# EAGLE design Gibbot (EAGLE 5.12)
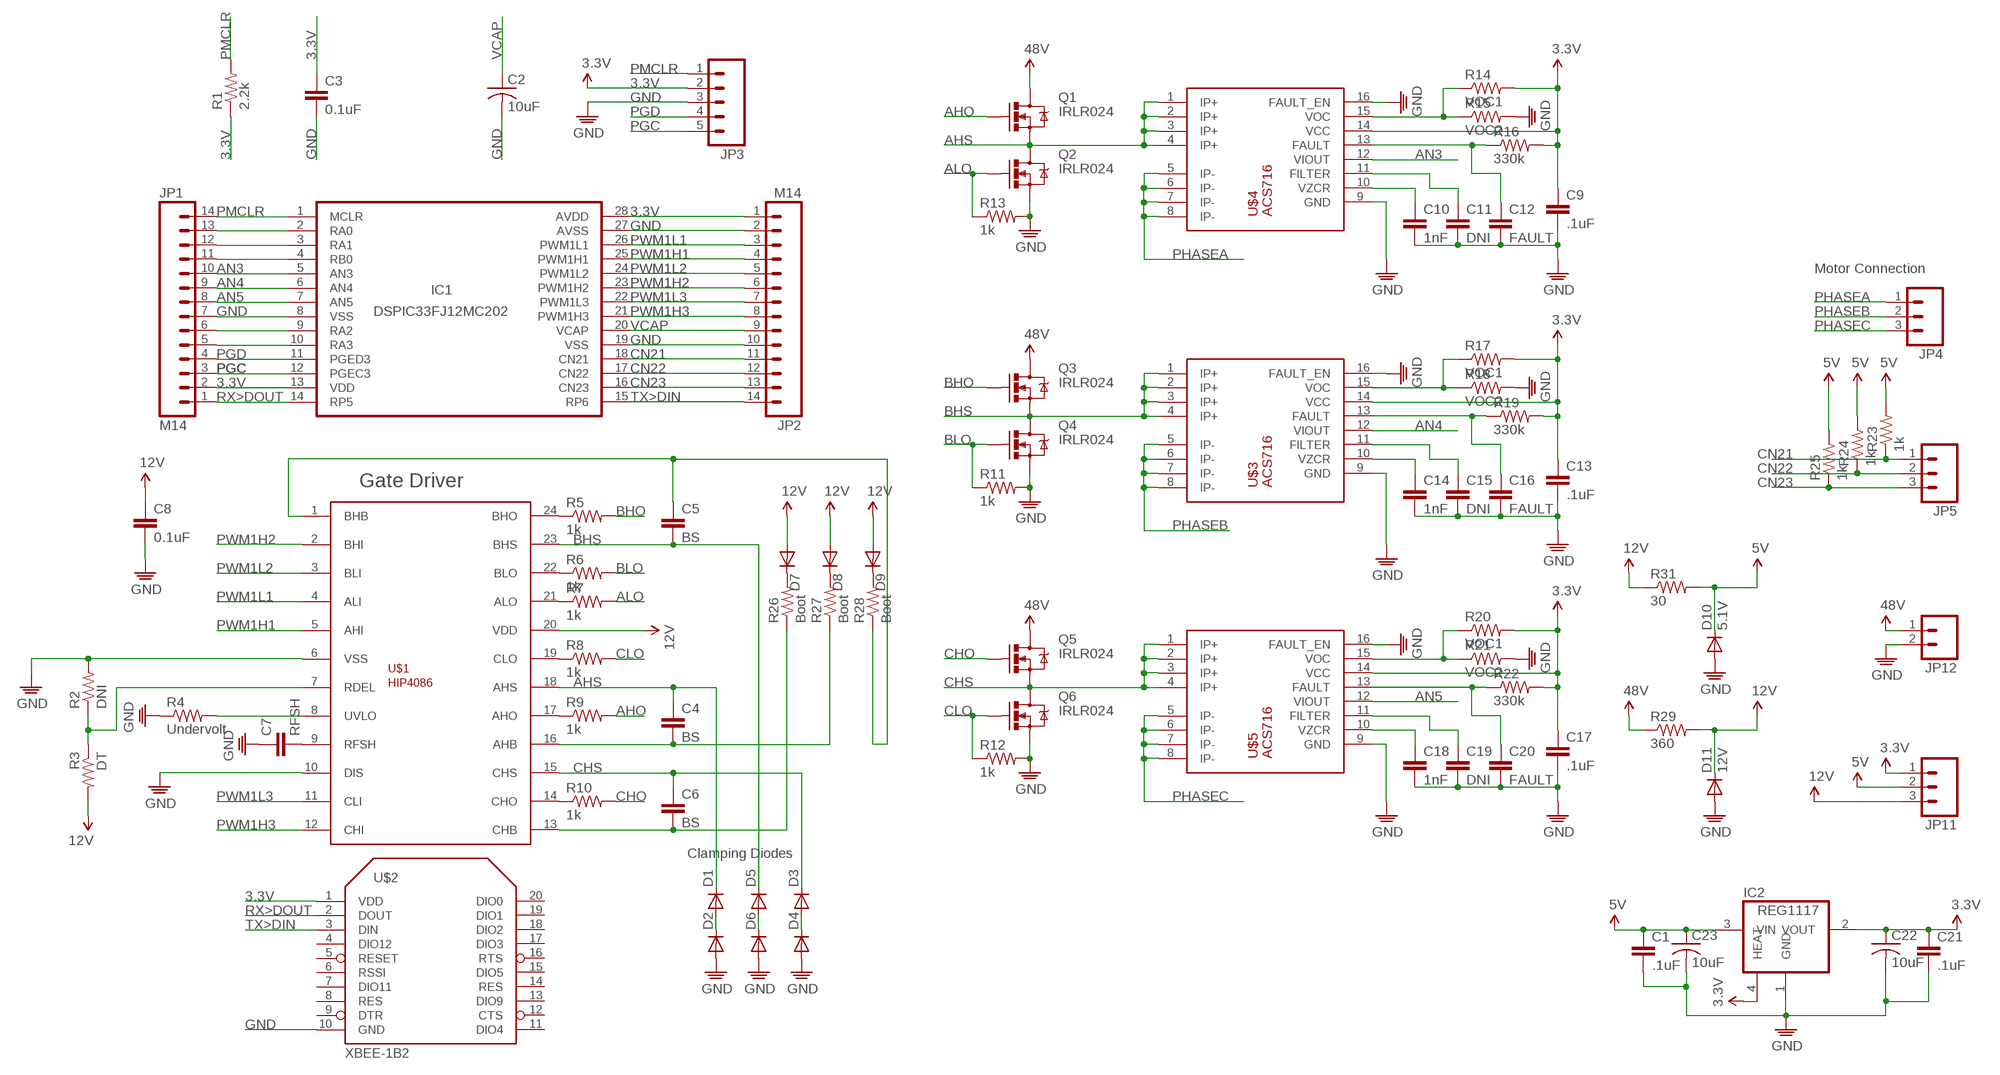
[diagram p0: schematic, sheet 1]

## Parts
C1  .1uF  CAP0603-CAP  [0603-CAP]
C2  10uF  C-USC0603  [C0603]
C3  0.1uF  CAP0603-CAP  [0603-CAP]
C4  BS  CAP0603-CAP  [0603-CAP]
C5  BS  CAP0603-CAP  [0603-CAP]
C6  BS  CAP0603-CAP  [0603-CAP]
C7  RFSH  CAP0603-CAP  [0603-CAP]
C8  0.1uF  CAP0603-CAP  [0603-CAP]
C9  .1uF  CAP0603-CAP  [0603-CAP]
C10  1nF  CAP0603-CAP  [0603-CAP]
C11  DNI  CAP0603-CAP  [0603-CAP]
C12  FAULT  CAP0603-CAP  [0603-CAP]
C13  .1uF  CAP0603-CAP  [0603-CAP]
C14  1nF  CAP0603-CAP  [0603-CAP]
C15  DNI  CAP0603-CAP  [0603-CAP]
C16  FAULT  CAP0603-CAP  [0603-CAP]
C17  .1uF  CAP0603-CAP  [0603-CAP]
C18  1nF  CAP0603-CAP  [0603-CAP]
C19  DNI  CAP0603-CAP  [0603-CAP]
C20  FAULT  CAP0603-CAP  [0603-CAP]
C21  .1uF  CAP0603-CAP  [0603-CAP]
C22  10uF  C-USC0603  [C0603]
C23  10uF  C-USC0603  [C0603]
D1  DIODEPTH  [DIODE-1N4001]
D2  DIODEPTH  [DIODE-1N4001]
D3  DIODEPTH  [DIODE-1N4001]
D4  DIODEPTH  [DIODE-1N4001]
D5  DIODEPTH  [DIODE-1N4001]
D6  DIODEPTH  [DIODE-1N4001]
D7  DIODEPTH  [DIODE-1N4001]
D8  DIODEPTH  [DIODE-1N4001]
D9  DIODEPTH  [DIODE-1N4001]
D10  5.1V  DIODEPTH  [DIODE-1N4001]
D11  12V  DIODEPTH  [DIODE-1N4001]
IC1  DSPIC33FJ12MC202  [SOIC28-W]
IC2  REG1117  [SOT223]
JP1  M14  [1X14]
JP2  M14  [1X14]
JP3  M05PTH  [1X05]
JP4  M03-SCREW-5MM  [SCREWTERMINAL-5MM-3]
JP5  M03-SCREW-5MM  [SCREWTERMINAL-5MM-3]
JP11  M03-SCREW-5MM  [SCREWTERMINAL-5MM-3]
JP12  M025MM  [SCREWTERMINAL-5MM-2]
Q1  IRLR024  [DPAK]
Q2  IRLR024  [DPAK]
Q3  IRLR024  [DPAK]
Q4  IRLR024  [DPAK]
Q5  IRLR024  [DPAK]
Q6  IRLR024  [DPAK]
R1  2.2k  R-US_R0603  [R0603]
R2  DNI  R-US_R0603  [R0603]
R3  DT  R-US_R0603  [R0603]
R4  Undervolt  R-US_R0603  [R0603]
R5  1k  R-US_R0603  [R0603]
R6  1k  R-US_R0603  [R0603]
R7  1k  R-US_R0603  [R0603]
R8  1k  R-US_R0603  [R0603]
R9  1k  R-US_R0603  [R0603]
R10  1k  R-US_R0603  [R0603]
R11  1k  R-US_R0603  [R0603]
R12  1k  R-US_R0603  [R0603]
R13  1k  R-US_R0603  [R0603]
R14  VOC1  R-US_R0603  [R0603]
R15  VOC2  R-US_R0603  [R0603]
R16  330k  R-US_R0603  [R0603]
R17  VOC1  R-US_R0603  [R0603]
R18  VOC2  R-US_R0603  [R0603]
R19  330k  R-US_R0603  [R0603]
R20  VOC1  R-US_R0603  [R0603]
R21  VOC2  R-US_R0603  [R0603]
R22  330k  R-US_R0603  [R0603]
R23  1k  R-US_R0603  [R0603]
R24  1k  R-US_R0603  [R0603]
R25  1k  R-US_R0603  [R0603]
R26  Boot  R-US_R0603  [R0603]
R27  Boot  R-US_R0603  [R0603]
R28  Boot  R-US_R0603  [R0603]
R29  360  R-US_SQP500  [SQP500]
R31  30  R-US_0414/17  [0414/17]
U$1  HIP4086  [SOIC24-W]
U$2  XBEE-1B2  [XBEE-SILK]
U$3  ACS716  [SOIC16-W]
U$4  ACS716  [SOIC16-W]
U$5  ACS716  [SOIC16-W]

## Nets
3.3V: C3.1 C9.1 C13.1 C17.1 C21.1 C22.1 IC1.13(VDD) IC1.28(AVDD) IC2.2(VOUT) IC2.4(HEAT) JP1.2 JP2.1 JP3.2 JP11.1 R1.1 R14.2 R16.2 R17.2 R19.2 R20.2 R22.2 U$2.1(VDD) U$3.14(VCC) U$4.14(VCC) U$5.14(VCC)
5V: C1.1 C23.1 D10.C IC2.3(VIN) JP11.2 R23.2 R24.2 R25.2 R31.2
12V: C8.1 D7.A D8.A D9.A D11.C JP11.3 R3.2 R29.P$2 R31.1 U$1.20(VDD)
48V: JP12.1 Q1.D Q3.D Q5.D R29.P$1
AHO: Q1.G R9.2
AHS: C4.1 D1.C Q1.S Q2.D U$1.18(AHS) U$4.1(IP+) U$4.2(IP+) U$4.3(IP+) U$4.4(IP+)
ALO: Q2.G R7.2 R13.1
AN3: IC1.5(AN3) JP1.10 U$4.12(VIOUT)
AN4: IC1.6(AN4) JP1.9 U$3.12(VIOUT)
AN5: IC1.7(AN5) JP1.8 U$5.12(VIOUT)
BHO: Q3.G R5.2
BHS: C5.2 D5.C Q3.S Q4.D U$1.23(BHS) U$3.1(IP+) U$3.2(IP+) U$3.3(IP+) U$3.4(IP+)
BLO: Q4.G R6.2 R11.1
CHO: Q5.G R10.2
CHS: C6.1 D3.C Q5.S Q6.D U$1.15(CHS) U$5.1(IP+) U$5.2(IP+) U$5.3(IP+) U$5.4(IP+)
CLO: Q6.G R8.2 R12.1
CN21: IC1.18(CN21) JP2.11 JP5.1 R23.1
CN22: IC1.17(CN22) JP2.12 JP5.2 R24.1
CN23: IC1.16(CN23) JP2.13 JP5.3 R25.1
GND: C1.2 C2.2 C3.2 C7.1 C8.2 C9.2 C10.2 C11.2 C12.2 C13.2 C14.2 C15.2 C16.2 C17.2 C18.2 C19.2 C20.2 C21.2 C22.2 C23.2 D2.A D4.A D6.A D10.A D11.A IC1.8(VSS) IC1.19(VSS) IC1.27(AVSS) IC2.1(GND) JP1.7 JP2.2 JP2.10 JP3.3 JP12.2 Q2.S Q4.S Q6.S R2.2 R4.1 R11.2 R12.2 R13.2 R15.2 R18.2 R21.2 U$1.6(VSS) U$1.10(DIS) U$2.10(GND) U$3.9(GND) U$3.16(FAULT_EN) U$4.9(GND) U$4.16(FAULT_EN) U$5.9(GND) U$5.16(FAULT_EN)
N$1: C4.2 R27.1 U$1.16(AHB)
N$2: C6.2 R26.1 U$1.13(CHB)
N$3: R4.2 U$1.8(UVLO)
N$4: C5.1 R28.1 U$1.1(BHB)
N$5: IC1.10(RA3) JP1.5
N$6: IC1.9(RA2) JP1.6
N$7: R2.1 R3.1 U$1.7(RDEL)
N$11: IC1.4(RB0) JP1.11
N$12: IC1.3(RA1) JP1.12
N$13: IC1.2(RA0) JP1.13
N$14: C7.2 U$1.9(RFSH)
N$15: R10.1 U$1.14(CHO)
N$16: R9.1 U$1.17(AHO)
N$17: R8.1 U$1.19(CLO)
N$18: R7.1 U$1.21(ALO)
N$19: R6.1 U$1.22(BLO)
N$20: R5.1 U$1.24(BHO)
N$24: D1.A D2.C
N$28: D3.A D4.C
N$29: D5.A D6.C
N$32: R14.1 R15.1 U$4.15(VOC)
N$33: C12.1 R16.1 U$4.13(FAULT)
N$35: C10.1 U$4.10(VZCR)
N$36: C11.1 U$4.11(FILTER)
N$37: R17.1 R18.1 U$3.15(VOC)
N$38: C16.1 R19.1 U$3.13(FAULT)
N$39: C14.1 U$3.10(VZCR)
N$40: C15.1 U$3.11(FILTER)
N$43: R20.1 R21.1 U$5.15(VOC)
N$44: C20.1 R22.1 U$5.13(FAULT)
N$45: C18.1 U$5.10(VZCR)
N$46: C19.1 U$5.11(FILTER)
N$53: D8.C R27.2
N$54: D9.C R28.2
N$55: D7.C R26.2
PGC: IC1.12(PGEC3) JP1.3 JP3.5
PGD: IC1.11(PGED3) JP1.4 JP3.4
PHASEA: JP4.1 U$4.5(IP-) U$4.6(IP-) U$4.7(IP-) U$4.8(IP-)
PHASEB: JP4.2 U$3.5(IP-) U$3.6(IP-) U$3.7(IP-) U$3.8(IP-)
PHASEC: JP4.3 U$5.5(IP-) U$5.6(IP-) U$5.7(IP-) U$5.8(IP-)
PMCLR: IC1.1(MCLR) JP1.14 JP3.1 R1.2
PWM1H1: IC1.25(PWM1H1) JP2.4 U$1.5(AHI)
PWM1H2: IC1.23(PWM1H2) JP2.6 U$1.2(BHI)
PWM1H3: IC1.21(PWM1H3) JP2.8 U$1.12(CHI)
PWM1L1: IC1.26(PWM1L1) JP2.3 U$1.4(ALI)
PWM1L2: IC1.24(PWM1L2) JP2.5 U$1.3(BLI)
PWM1L3: IC1.22(PWM1L3) JP2.7 U$1.11(CLI)
RX>DOUT: IC1.14(RP5) JP1.1 U$2.2(DOUT)
TX>DIN: IC1.15(RP6) JP2.14 U$2.3(DIN)
VCAP: C2.1 IC1.20(VCAP) JP2.9
Unconnected: U$2.4(DIO12) U$2.5(RESET) U$2.6(RSSI) U$2.7(DIO11) U$2.8(RES) U$2.9(DTR) U$2.11(DIO4) U$2.12(CTS) U$2.13(DIO9) U$2.14(RES) U$2.15(DIO5) U$2.16(RTS) U$2.17(DIO3) U$2.18(DIO2) U$2.19(DIO1) U$2.20(DIO0)

## Notes on the sheet
- Motor Connection
- Gate Driver
- Clamping Diodes

## Library data of the parts
C1 C3-C21 = Gibbot:CAP: Capacitor Standard 0603 ceramic capacitor, and 0.1" leaded capacitor.
C2 C22 C23 = Gibbot:C-US: CAPACITOR, American symbol
D1-D11 = Gibbot:DIODE: Diode These are standard reverse protection diodes and small signal diodes. SMA package can handle up to about 1A. SOD-323 can handle about 200mA. What the SOD-323 package when ordering, there are some mfgs out there that are 5-pin packages.
IC1 = Gibbot:DSPIC33FJ12MC202: dsPIC33FJ12MC202 edit this description Auto generated by make-symbol-device-package-bsdl.ulp Rev. 25 Source: dsPIC33FJ12MC202.bsd
IC2 = Gibbot:REG1117: 800mA and 1A Low Dropout (LDO) Positive Regulator 1.8V, 2.5V, 2.85V, 3.3V, 5V, and Adj
JP1 JP2 = Gibbot:M14: Header 14 Standard 14-pin 0.1" header. Use with straight break away headers (SKU : PRT-00116), right angle break away headers (PRT-00553), swiss pins (PRT-00743), machine pins (PRT-00117), and female headers (PRT-00115).
JP3 = Gibbot:M05: Header 5 Standard 5-pin 0.1" header. Use with straight break away headers (SKU : PRT-00116), right angle break away headers (PRT-00553), swiss pins (PRT-00743), machine pins (PRT-00117), and female headers (PRT-00115). Molex polarized connector foot print use with SKU : PRT-08230 with associated crimp pins and housings.
JP4 JP5 JP11 = Gibbot:M03: Header 3 Standard 3-pin 0.1" header. Use with straight break away headers (SKU : PRT-00116), right angle break away headers (PRT-00553), swiss pins (PRT-00743), machine pins (PRT-00117), and female headers (PRT-00115). Molex polarized connector foot print use with SKU : PRT-08232 with associated crimp pins and housings.
JP12 = Gibbot:M02: Header 2 Standard 2-pin 0.1" header. Use with straight break away headers (SKU : PRT-00116), right angle break away headers (PRT-00553), swiss pins (PRT-00743), machine pins (PRT-00117), and female headers (PRT-00115). Molex polarized connector foot print use with SKU : PRT-08233 with associated crimp pins and housings.
Q1-Q6 = Gibbot:IRLR024
R1-R29 R31 = Gibbot:R-US_: RESISTOR, American symbol
U$1 = Gibbot:HIP4086
U$2 = Gibbot:XBEE-1
U$3-U$5 = Gibbot:ACS716

## Board
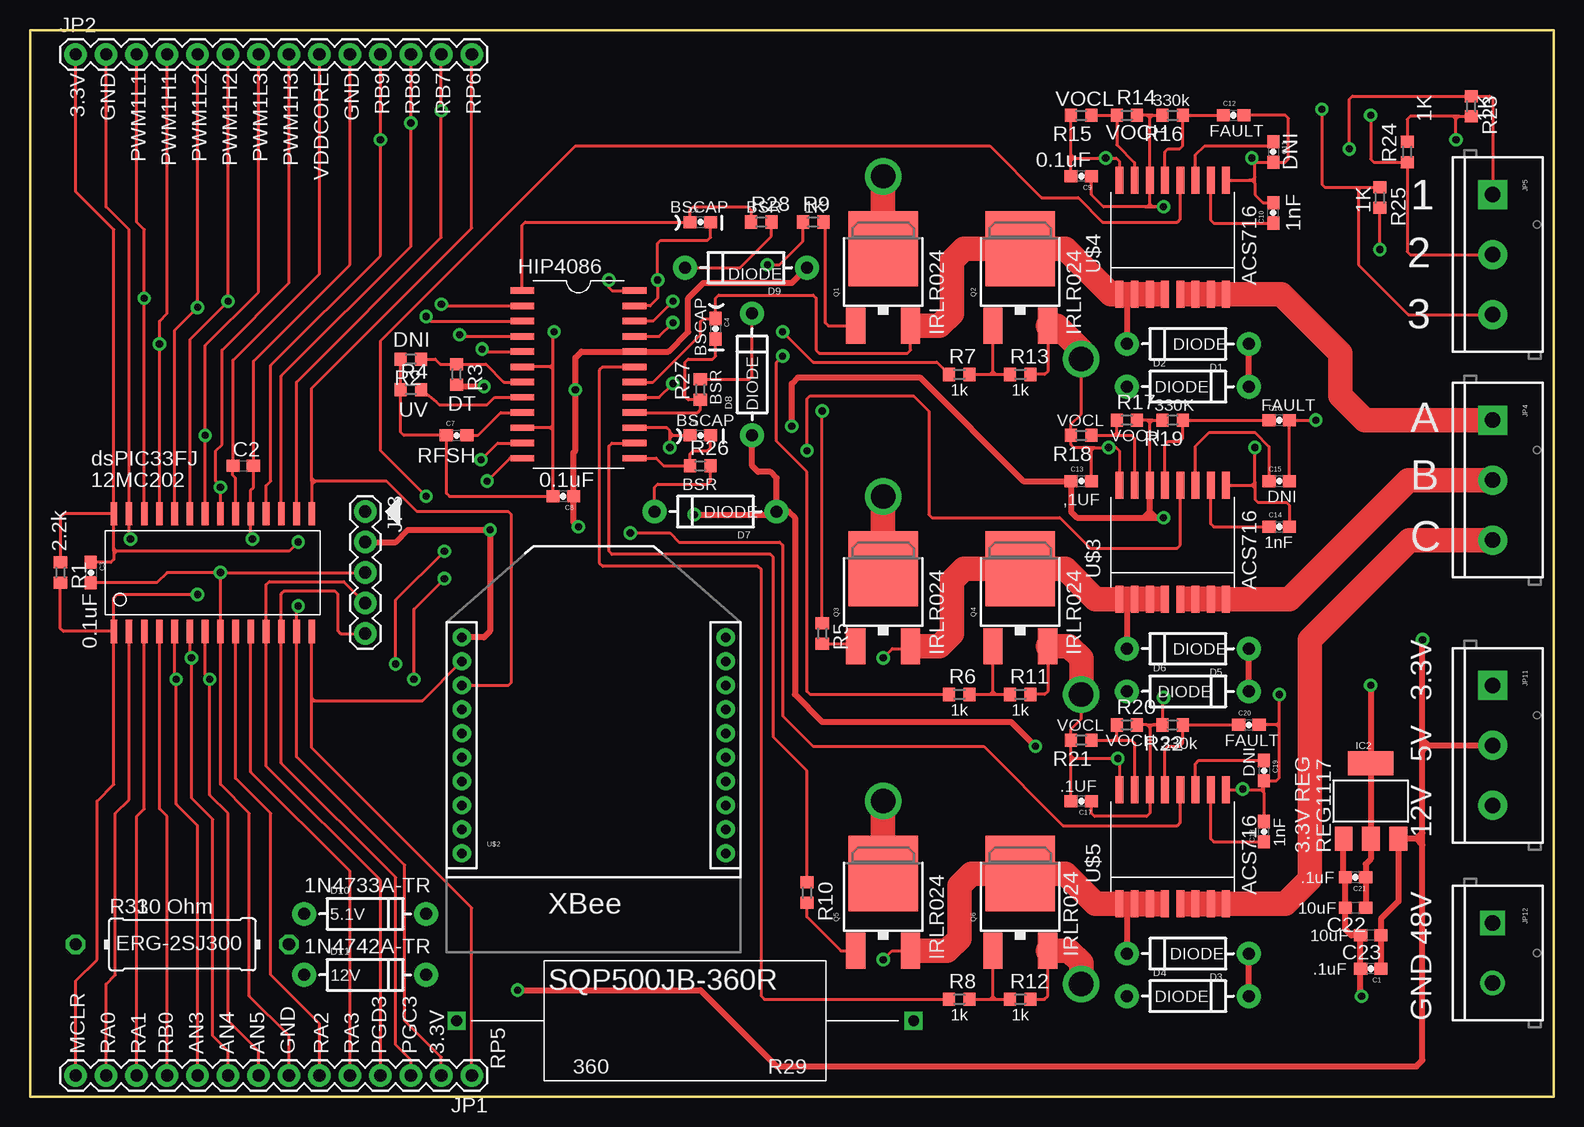
[diagram p1: board, top side]
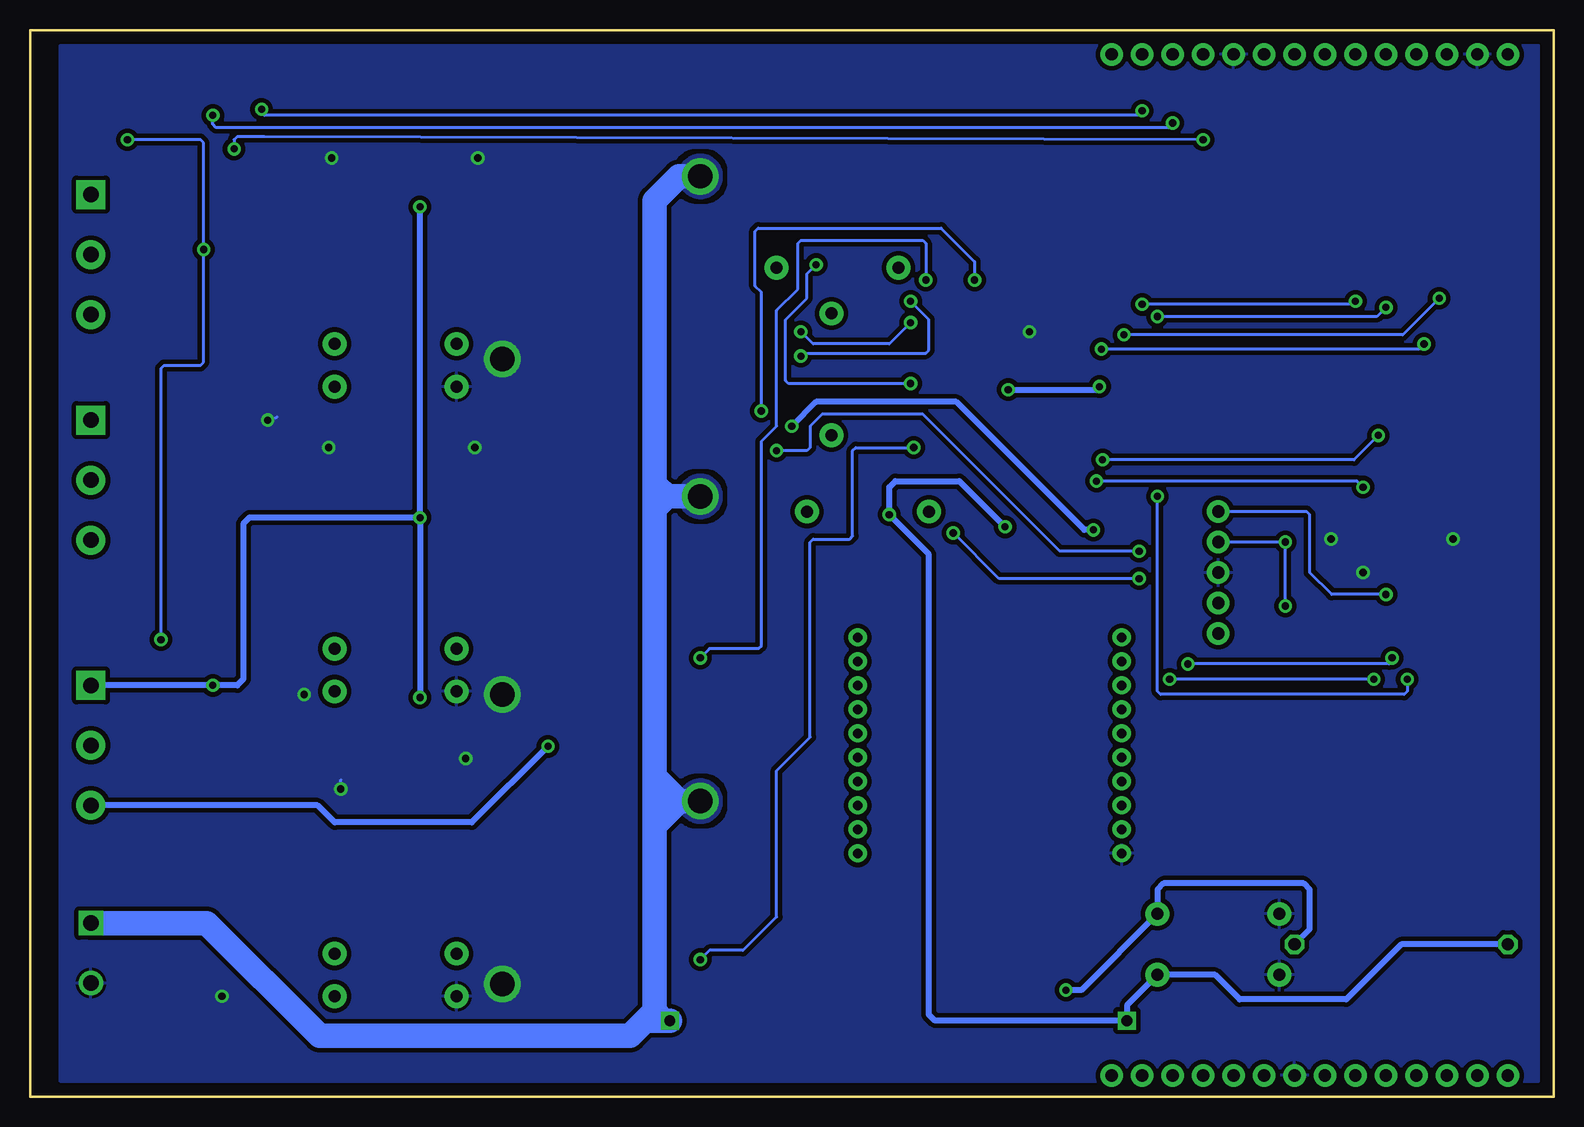
[diagram p2: board, bottom side, seen from below]

Size 127 x 88.9 mm. Coordinates in mm from the lower left corner, seen from the top.
Outline: 0,0 127,0 127,88.9 0,88.9 0,0
Copper layers (1*16): Top 0.035mm / dielectric 1.5mm / Bottom 0.035mm
Design rules "SparkFun": minimum track width 8mil, minimum drill 20mil, track to track 8mil, track to pad 8mil, pad to pad 8mil, via to via 8mil, smd to smd 8mil, copper to edge 10mil, drill to drill 8mil, minimum pad ring 12mil, minimum via ring 10mil, stop-mask expansion 4mil, vias tented up to drill 25mil, thermal gap 10mil
Holes 1.1 mm at -3.81,3.81

### Footprints (pad centres in the part's own frame; a part is rotated, then mirrored left to right if it is on the bottom)
0603-CAP = smd 1.1 x 1: 1 -0.85,0; 2 0.85,0
C0603 = smd 1.1 x 1: 1 -0.85,0; 2 0.85,0
DIODE-1N4001 = drill 1 pad 1.981 round: A -5.08,0; C 5.08,0
SOIC28-W = smd 0.55 x 1.95: 1 -8.255,-4.9; 2 -6.985,-4.9; 3 -5.715,-4.9; 4 -4.445,-4.9; 5 -3.175,-4.9; 6 -1.905,-4.9; 7 -0.635,-4.9; 8 0.635,-4.9; 9 1.905,-4.9; 10 3.175,-4.9; 11 4.445,-4.9; 12 5.715,-4.9; 13 6.985,-4.9; 14 8.255,-4.9; 15 8.255,4.9; 16 6.985,4.9; 17 5.715,4.9; 18 4.445,4.9; 19 3.175,4.9; 20 1.905,4.9; 21 0.635,4.9; 22 -0.635,4.9; 23 -1.905,4.9; 24 -3.175,4.9; 25 -4.445,4.9; 26 -5.715,4.9; 27 -6.985,4.9; 28 -8.255,4.9
SOT223 = smd 1.499 x 2.007: 1 -2.261,-3.15; 2 0.025,-3.15; 3 2.311,-3.15 | smd 3.81 x 2.007: 4 0,3.15
1X14 = drill 1.016 pad 1.88 round: 1 0,0; 2 2.54,0; 3 5.08,0; 4 7.62,0; 5 10.16,0; 6 12.7,0; 7 15.24,0; 8 17.78,0; 9 20.32,0; 10 22.86,0; 11 25.4,0; 12 27.94,0; 13 30.48,0; 14 33.02,0
1X05 = drill 1.016 pad 1.88 round: 1 0,0; 2 2.54,0; 3 5.08,0; 4 7.62,0; 5 10.16,0
SCREWTERMINAL-5MM-3 = drill 1.3 pad 2.413 square: 1 0,0 | drill 1.3 pad 2.413 round: 2 5,0; 3 10,0
SCREWTERMINAL-5MM-2 = drill 1.3 pad 2.032 square: 1 0,0 | drill 1.3 pad 2.032 round: 2 5,0
DPAK = smd 5.791 x 6.274: D 0,1.587 | smd 1.6 x 3: G -2.286,-4.851; S 2.286,-4.851
R0603 = smd 1 x 1.1: 1 -0.85,0; 2 0.85,0
SQP500 = drill 0.9 square: P$1 -19.05,0; P$2 19.05,0
0414/17 = drill 1.016 octagon: 1 -8.89,0; 2 8.89,0
SOIC24-W = smd 0.533 x 1.981: 1 -6.985,-4.686; 2 -5.715,-4.686; 3 -4.445,-4.686; 4 -3.175,-4.686; 5 -1.905,-4.686; 6 -0.635,-4.686; 7 0.635,-4.686; 8 1.905,-4.686; 9 3.175,-4.686; 10 4.445,-4.686; 11 5.715,-4.686; 12 6.985,-4.686; 13 6.985,4.686; 14 5.715,4.686; 15 4.445,4.686; 16 3.175,4.686; 17 1.905,4.686; 18 0.635,4.686; 19 -0.635,4.686; 20 -1.905,4.686; 21 -3.175,4.686; 22 -4.445,4.686; 23 -5.715,4.686; 24 -6.985,4.686
XBEE-SILK = drill 0.8 pad 1.524 round: 1 -11,20; 2 -11,18; 3 -11,16; 4 -11,14; 5 -11,12; 6 -11,10; 7 -11,8; 8 -11,6; 9 -11,4; 10 -11,2; 11 11,2; 12 11,4; 13 11,6; 14 11,8; 15 11,10; 16 11,12; 17 11,14; 18 11,16; 19 11,18; 20 11,20
SOIC16-W = smd 0.65 x 2.25: 1 -4.445,-4.75; 2 -3.175,-4.75; 3 -1.905,-4.75; 4 -0.635,-4.75; 5 0.635,-4.75; 6 1.905,-4.75; 7 3.175,-4.75; 8 4.445,-4.75; 9 4.445,4.75; 10 3.175,4.75; 11 1.905,4.75; 12 0.635,4.75; 13 -0.635,4.75; 14 -1.905,4.75; 15 -3.175,4.75; 16 -4.445,4.75

### Placement (x,y rotation side)
C1  111.76,10.67 180 top
C2  17.78,52.58 0 top
C3  5.08,43.69 270 top
C4  57.15,64.01 270 top
C5  55.88,72.9 0 top
C6  55.88,55.12 0 top
C7  35.56,55.12 0 top
C8  44.45,50.04 180 top
C9  87.63,76.71 180 top
C10  103.63,73.66 90 top
C11  103.63,78.74 270 top
C12  100.33,81.79 0 top
C13  87.63,51.31 0 top
C14  104.14,47.5 0 top
C15  104.14,51.31 0 top
C16  104.14,56.39 0 top
C17  87.63,24.64 180 top
C18  102.87,22.1 90 top
C19  102.87,27.18 270 top
C20  101.6,30.99 0 top
C21  110.49,18.29 180 top
C22  110.49,15.75 180 top
C23  111.76,13.46 180 top
D1  96.52,62.74 180 top
D2  96.52,59.18 0 top
D3  96.52,11.94 180 top
D4  96.52,8.38 0 top
D5  96.52,37.34 180 top
D6  96.52,33.78 0 top
D7  57.15,48.77 180 top
D8  60.2,60.2 90 top
D9  59.69,69.09 180 top
D10  27.94,15.24 0 top
D11  27.94,10.16 0 top
IC1  15.24,43.69 0 top
IC2  111.76,24.64 0 top
JP1  36.83,1.78 180 top
JP2  3.81,86.87 0 top
JP3  27.94,48.77 270 top
JP4  121.92,56.39 270 top
JP5  121.92,75.18 270 top
JP11  121.92,34.29 270 top
JP12  121.92,14.48 270 top
Q1  71.12,69.09 0 top
Q2  82.55,69.09 0 top
Q3  71.12,42.42 0 top
Q4  82.55,42.42 0 top
Q5  71.12,17.02 0 top
Q6  82.55,17.02 0 top
R1  2.54,43.69 270 top
R2  31.75,61.47 180 top
R3  35.56,60.2 270 top
R4  31.75,58.93 0 top
R5  66.04,38.61 270 top
R6  77.47,33.53 0 top
R7  77.47,60.2 0 top
R8  77.47,8.13 0 top
R9  65.28,72.9 0 top
R10  64.77,17.02 270 top
R11  82.55,33.53 0 top
R12  82.55,8.13 0 top
R13  82.55,60.2 0 top
R14  91.44,81.79 0 top
R15  87.63,81.79 180 top
R16  95.25,81.79 180 top
R17  91.44,56.39 0 top
R18  87.63,55.12 180 top
R19  95.25,56.39 180 top
R20  91.44,30.99 0 top
R21  87.63,29.72 180 top
R22  95.25,30.99 180 top
R23  120.14,82.55 270 top
R24  114.81,78.74 90 top
R25  112.52,74.93 270 top
R26  55.88,52.58 0 top
R27  55.88,58.93 90 top
R28  60.96,72.9 0 top
R29  54.61,6.35 180 top
R31  12.7,12.7 0 top
U$1  45.72,60.2 270 top
U$2  46.99,18.29 0 top
U$3  95.25,46.23 0 top
U$4  95.25,71.63 0 top
U$5  95.25,20.83 0 top

### Tracks (layer width: path | path; a pad name or v marks a point on that pad's centre or on a via)
3.3V  (via drill 0.6)
  Top 0.254: 93.34,74.42 93.09,74.17 92.96,74.17 | 93.34,74.42 U$4.14 93.34,81.53 | 93.6,81.79 R16.2 | 93.34,81.53 93.6,81.79 | 93.09,81.79 R14.2 | 93.34,81.53 93.09,81.79 | 93.6,81.79 93.09,81.79 | 93.34,56.13 93.6,56.39 | 93.6,56.39 R19.2 94.49,56.48 | 93.09,56.39 R17.2 | 93.34,56.13 93.09,56.39 | U$3.14 93.34,56.13 | 93.6,56.39 93.09,56.39 | 92.96,74.17 89.5,74.17 88.48,75.18 C9.1 | 93.34,30.73 U$5.14 93.34,23.62 93.09,23.37 88.73,23.37 88.48,23.62 C17.1 | 93.34,30.73 93.6,30.99 R22.2 94.4,33.19 v94.49,33.27 | 93.09,30.99 R20.2 | 93.34,30.73 93.09,30.99 | 93.09,30.99 93.85,30.99 | v22.35,40.89 22.23,40.89 IC1.13 22.23,28.32 31.24,19.3 31.24,6.35 34.29,3.3 JP1.2 | 6.99,45.47 6.99,45.72 | 6.99,45.72 IC1.28 | C3.1 6.73,44.54 6.99,44.79 6.99,45.21 | 6.99,45.47 6.99,45.21 | v22.35,46.23 21.59,45.47 7.24,45.47 | 7.24,45.47 6.99,45.47 | 7.24,45.47 6.99,45.72 | 7.24,45.47 6.99,45.21 | JP2.1 3.81,75.44 6.99,72.26 IC1.28 | R1.1 2.54,48.33 2.79,48.59 IC1.28 | IC2.2 111.76,21.01 | 93.34,74.42 93.6,74.17 v94.49,74.17 | 92.96,74.17 93.85,74.17
  Top 0.508: JP3.2 30.48,46.23 31.5,47.24 v38.35,47.24 38.35,38.8 37.85,38.29 U$2.1 | C22.1 C21.1 111.34,19.39 111.76,19.81 111.76,21.46 IC2.2 111.76,21.51 IC2.4 v111.76,34.29 | v63.5,55.88 63.5,59.44 64.01,59.94 74.17,59.94 82.8,51.31 C13.1 86.78,48.77 87.29,48.26 92.84,48.26 | 92.84,48.26 93.34,48.77 | 93.34,48.77 U$3.14 | 93.34,48.77 93.85,48.26 v94.49,48.26 | 92.84,48.26 94.11,48.26
  Bottom 0.254: JP3.2 v22.35,46.23 v22.35,40.89
  Bottom 0.508: v38.35,47.24 39.12,47.24 49.78,57.91 61.47,57.91 v63.5,55.88 | v94.49,48.26 v94.49,33.27 | v94.49,48.26 v94.49,74.17 | v94.49,48.26 108.71,48.26 109.22,47.75 109.22,34.8 109.73,34.29 v111.76,34.29 JP11.1
5V  (via drill 0.6)
  Top 0.254: v112.52,70.61 R25.2 | 119.13,81.7 R23.2 | 118.87,81.45 119.13,81.7 | 118.87,81.45 118.62,81.7 | v118.87,79.76 118.87,81.45 | R24.2 114.81,81.45 115.06,81.7 119.13,81.7
  Top 0.508: 116.59,29.29 JP11.2 | 116.59,29.29 116.08,29.8 | 116.08,29.8 v116.08,38.1 | 116.08,28.78 116.59,29.29 | 115.57,21.49 IC2.3 114.07,16.28 112.61,14.82 C23.1 C1.1 | 115.57,21.49 116.08,22 | 116.08,22 116.08,28.78 | 116.08,20.98 115.57,21.49 | 116.08,20.98 116.08,3.05 115.57,2.54 62.23,2.54 55.88,8.89 v40.64,8.89 | 116.08,20.98 116.08,22 | 116.08,28.78 116.08,29.8
  Bottom 0.254: v118.87,79.76 112.78,79.76 112.52,79.5 v112.52,70.61 112.52,61.21 112.78,60.96 115.82,60.96 116.08,60.71 v116.08,38.1
  Bottom 0.508: R31.2 20.32,13.97 20.32,17.27 20.83,17.78 32.51,17.78 33.02,17.27 D10.C 39.37,8.89 v40.64,8.89
12V  (via drill 0.6)
  Top 0.508: v37.85,59.18 35.73,59.18 R3.2 | v83.82,29.21 81.79,31.24 66.04,31.24 63.75,33.53 63.75,48.26 63.25,48.77 D7.A | v45.72,47.5 45.3,47.92 C8.1 45.3,53.68 45.47,53.85 v45.47,58.93 45.47,61.59 45.97,62.1 U$1.20 53.21,62.1 54.86,63.75 54.86,66.55 56.13,67.82 63.5,67.82 D9.A | D7.A 61.98,48.51 v55.37,48.51 | D7.A 62.23,51.56 61.72,52.07 60.71,52.07 60.2,52.58 D8.A
  Bottom 0.508: v37.85,59.18 38.1,58.93 v45.47,58.93 | JP11.3 103.03,24.29 101.6,22.86 90.17,22.86 v83.82,29.21 | R31.1 12.7,12.7 17.27,8.13 26.16,8.13 28.19,10.16 D11.C 35.56,7.62 R29.P$2 51.56,6.35 52.07,6.86 52.07,45.21 v55.37,48.51 55.37,50.8 54.86,51.31 49.53,51.31 v45.72,47.5
48V  (via drill 2.03)
  Top 0.254: 71.12,44.96 Q3.D
  Top 2.032: v71.12,24.64 Q5.D | v71.12,50.04 71.12,44.96 | v71.12,76.71 Q1.D
  Bottom 2.032: 72.9,24.64 74.93,26.67 74.93,49.02 | 74.93,49.02 74.93,51.05 | v71.12,76.71 72.9,76.71 74.93,74.68 74.93,51.05 | 74.93,51.05 73.91,50.04 | 73.91,50.04 v71.12,50.04 | 74.93,49.02 73.91,50.04 | 72.9,24.64 v71.12,24.64 | 74.93,22.61 72.9,24.64 | 74.93,22.61 74.93,26.42 | 74.93,7.11 74.93,22.61 | 74.93,7.11 76.96,5.08 102.87,5.08 112.27,14.48 JP12.1 | 74.17,6.35 74.93,7.11 | R29.P$1 74.17,6.35 | 74.17,6.35 75.69,6.35
  pour Bottom (isolate 0.635, rank 2): 69.34,24.64 arc-90 71.12,26.42 arc-90 72.9,24.64 arc-90 71.12,22.86 arc-90
  pour Bottom (isolate 0.635, rank 2): 69.34,50.04 arc-90 71.12,51.82 arc-90 72.9,50.04 arc-90 71.12,48.26 arc-90
  pour Bottom (isolate 0.635, rank 2): 69.34,76.71 arc-90 71.12,78.49 arc-90 72.9,76.71 arc-90 71.12,74.93 arc-90
AHO
  Top 0.254: 68.58,64.01 68.81,64.24 Q1.G 66.55,64.24 66.29,64.49 66.29,72.73 R9.2
AHS
  Top 0.254: 74.17,64.24 Q1.S 73.41,62.23 73.15,61.98 65.79,61.98 65.53,62.23 65.53,66.55 65.28,66.8 57.4,66.8 57.15,66.55 C4.1 56.13,64.86 55.88,64.6 55.88,63.5 51.94,59.56 U$1.18
  Top 0.508: U$4.4 U$4.3 U$4.2 91.44,66.88 | U$4.1 91.44,66.88 | 91.44,66.88 D1.C
  Top 2.032: 74.17,64.24 75.82,64.24 76.83,65.25 76.83,69.66 77.85,70.67 Q2.D 86.3,70.67 90.09,66.88 U$4.1
ALO
  Top 0.254: 80.26,60.45 80.52,60.2 R13.1 | R7.2 80.01,60.2 | 80.01,60.2 80.26,60.45 | 80.26,60.45 Q2.G | 80.01,60.2 80.43,60.2
AN3  (via drill 0.6)
  Top 0.254: U$4.12 95.89,73.15 95.63,72.9 89.41,72.9 87.38,74.93 84.33,74.93 80.01,79.25 45.47,79.25 29.21,62.99 29.21,53.85 v33.02,50.04 | IC1.5 12.06,34.92 v12.19,34.8 12.19,24.38 13.97,22.61 JP1.10
  Bottom 0.254: v33.02,50.04 33.02,33.78 32.77,33.53 12.45,33.53 12.19,33.78 v12.19,34.8
AN4  (via drill 0.6)
  Top 0.254: U$3.12 95.89,45.97 95.63,45.72 88.39,45.72 85.85,48.26 75.18,48.26 74.93,48.51 74.93,57.15 73.66,58.42 65.02,58.42 64.77,58.17 v64.77,53.85 | v34.54,45.47 30.48,41.4 v30.48,36.07 | IC1.6 13.34,36.7 v13.46,36.58 13.46,24.89 15.24,23.11 15.24,5.08 16.51,3.81 JP1.9
  Bottom 0.254: v30.48,36.07 13.72,36.07 13.46,36.32 v13.46,36.58 | v34.54,45.47 41.15,45.47 52.58,56.9 60.96,56.9 61.98,55.88 61.98,54.1 62.23,53.85 v64.77,53.85
AN5  (via drill 0.6)
  Top 0.254: U$5.12 95.89,22.86 95.63,22.61 86.11,22.61 79.5,29.21 65.28,29.21 62.74,31.75 62.74,45.97 62.48,46.23 54.1,46.23 53.34,46.99 v50.04,46.99 | v34.54,43.18 32,40.64 v32,34.8 | IC1.7 14.61,35.18 v14.99,34.8 14.99,25.15 16.51,23.62 16.51,6.35 19.05,3.81 JP1.8
  Bottom 0.254: v14.99,34.8 v32,34.8 | v34.54,43.18 46.23,43.18 v50.04,46.99
BHO
  Top 0.254: R5.2 68.64,37.76 Q3.G
BHS  (via drill 0.6)
  Top 0.254: 74.07,37.57 Q3.S 73.13,37.57 72.9,37.34 71.88,37.34 v71.12,36.58 | 91.83,41.23 91.69,41.23 91.44,41.48 | U$1.23 51.69,65.91 52.32,66.55 v52.32,68.07 52.32,71.12 52.58,71.37 56.48,71.37 56.73,71.63 C5.2
  Top 0.508: 91.83,41.23 U$3.2 | U$3.2 U$3.3 U$3.4 | D5.C 91.44,41.22 91.69,41.48 U$3.2
  Top 2.032: 74.07,37.57 75.82,37.57 76.83,38.58 76.83,42.99 77.85,44.01 Q4.D 86.3,44.01 88.82,41.48 U$3.1 91.44,41.48
  Bottom 0.254: v71.12,36.58 70.36,37.34 66.29,37.34 66.04,37.59 66.04,54.61 64.77,55.88 64.77,65.53 62.99,67.31 62.99,71.12 62.74,71.37 52.58,71.37 52.32,71.12 v52.32,68.07
BLO
  Top 0.254: R11.1 80.52,33.53 80.26,33.78 | R6.2 80.01,33.53 | 80.01,33.53 80.26,33.78 | 80.26,33.78 Q4.G | 80.01,33.53 80.43,33.53
CHO
  Top 0.254: Q5.G 67.59,12.17 64.77,14.99 R10.2
CHS  (via drill 0.6)
  Top 0.254: 74.07,12.17 Q5.S 71.86,12.17 v71.12,11.43 | U$1.15 53.09,55.75 53.34,55.5 53.34,55.37 | v53.34,54.1 53.34,54.86 | 53.34,54.86 53.34,55.37 | 53.59,55.12 C6.1 | 53.34,55.37 53.59,55.12 | 53.34,54.86 53.59,55.12
  Top 0.508: 90.17,16.08 90.56,16.08 | U$5.1 91.44,16.08 | 91.44,16.08 U$5.2 U$5.3 U$5.4 | 91.44,16.08 D3.C
  Top 2.032: 74.07,12.17 76.45,12.17 77.47,13.18 77.47,17.59 78.49,18.61 Q6.D 86.3,18.61 88.82,16.08 90.17,16.08 U$5.1
  Bottom 0.254: v71.12,11.43 70.36,12.19 67.56,12.19 64.77,14.99 64.77,27.18 61.98,29.97 61.98,46.23 61.72,46.48 58.67,46.48 58.42,46.74 58.42,53.85 58.17,54.1 v53.34,54.1
CLO
  Top 0.254: 80.01,8.13 80.26,8.38 | R8.2 80.01,8.13 | 80.01,8.13 80.52,8.13 | 80.52,8.13 R12.1 | 80.26,8.38 80.52,8.13 | 80.26,8.38 Q6.G
CN21  (via drill 0.6)
  Top 0.254: JP2.11 29.21,81.28 v29.21,79.76 29.21,70.1 20.07,60.96 20.07,51.31 19.68,50.93 IC1.18 | JP5.1 121.92,83.15 121.67,83.4 R23.1 110.24,83.4 109.98,83.15 v109.98,78.99
  Bottom 0.254: v109.98,78.99 109.98,79.76 109.73,80.01 107.44,80.01 29.46,79.76 v29.21,79.76
CN22  (via drill 0.6)
  Top 0.254: IC1.17 20.95,60.07 31.75,70.87 v31.75,81.15 JP2.12 | JP5.2 115.06,70.18 114.81,70.44 R24.1 112.01,77.89 111.76,78.14 v111.76,81.79
  Bottom 0.254: v111.76,81.79 111.76,81.03 111.51,80.77 31.75,80.77 v31.75,81.15
CN23  (via drill 0.6)
  Top 0.254: IC1.16 22.23,59.56 34.29,71.63 v34.29,82.17 JP2.13 | 110.74,75.53 111,75.78 R25.1 | JP5.3 114.9,65.18 110.74,69.34 110.74,75.53 | v107.7,82.3 107.7,76.03 107.95,75.78 110.49,75.78 | 110.49,75.78 110.74,75.53 | 110.49,75.78 111.76,75.78
  Bottom 0.254: v107.7,82.3 107.7,82.04 107.44,81.79 34.29,81.79 v34.29,82.17
GND  (via drill 0.6, 2.03)
  Top 0.254: R13.2 84.58,60.2 84.84,60.45 Q2.S | Q4.S 84.84,33.78 84.58,33.53 R11.2 | R12.2 84.58,8.13 84.84,8.38 Q6.S | R2.2 R4.1 30.9,55.37 31.15,55.12 C7.1 34.71,50.29 34.96,50.04 C8.2 43.6,54.74 | U$4.9 101.85,76.38 | 101.85,76.38 102.11,76.12 | 102.11,76.12 102.11,75.18 102.78,74.51 C10.2 | 102.11,77.98 v101.85,78.23 | 102.11,76.12 102.11,76.63 | 102.11,76.63 102.11,77.98 | 102.11,76.63 101.85,76.38 | 101.85,76.38 101.6,76.38 | C15.2 C16.2 | C16.2 105.41,56.39 | 101.85,50.98 102.11,50.72 102.11,49.78 102.36,49.53 104.74,49.53 104.99,49.28 C14.2 | 102.11,51.23 v102.11,54.1 | 101.85,50.98 102.11,51.23 | U$3.9 101.85,50.98 | 102.11,51.23 102.11,50.8 | U$4.16 90.81,77.98 90.55,78.23 v89.66,78.23 87.03,78.23 | U$3.16 90.81,53.85 90.55,54.1 v89.92,54.1 88.73,54.1 | C9.2 86.78,77.98 | 86.78,77.98 87.03,78.23 | 86.78,78.49 R15.2 | 87.03,78.23 86.78,78.49 | 86.78,77.98 86.78,78.49 | 88.73,54.1 88.21,54.1 | v87.63,61.47 87.63,56.9 86.78,56.05 R18.2 86.78,54.36 87.03,54.1 88.21,54.1 | U$5.16 90.81,28.07 v90.68,28.19 87.03,28.19 | C17.2 86.78,27.94 | 86.78,27.94 87.03,28.19 | 86.78,28.45 R21.2 86.78,30.65 87.63,31.5 v87.63,33.53 | 87.03,28.19 86.78,28.45 | 86.78,27.94 86.78,28.45 | v15.88,43.69 JP3.3 | C3.2 10.58,42.84 11.43,43.69 v15.88,43.69 | v15.88,43.69 IC1.8 15.88,26.04 18.29,23.62 18.29,8.38 21.59,5.08 JP1.7 | v8.38,46.48 8.26,46.61 IC1.27 8.26,72.26 6.35,74.17 JP2.2 | v18.54,46.48 18.41,46.61 IC1.19 18.41,50.55 18.63,50.76 C2.2 18.63,61.3 26.67,69.34 JP2.10 | C13.2 88.48,53.85 88.73,54.1 | 88.21,54.1 88.47,53.85 | 102.11,77.98 102.2,77.89 C11.2 104.65,77.89 104.9,78.14 104.9,81.53 104.65,81.79 C12.2 | 43.6,60.58 43.6,60.57
  Top 0.254: 104.14,30.73 104.14,26.58 103.89,26.33 C19.2 102.87,25.83 102.62,25.58 | 104.14,30.73 103.89,30.99 | 102.62,25.58 102.87,25.32 | 102.87,25.32 C18.2 | 102.87,25.32 102.87,26.59 | U$5.9 101.02,25.58 v101.09,25.65 101.17,25.58 102.62,25.58 | C16.2 v107.19,56.39 | 103.89,30.99 C20.2 | 103.89,30.99 104.14,31.24 v104.14,33.53 | 104.14,30.73 104.14,32.26 | 43.6,60.58 43.35,60.83 | 43.6,60.58 43.6,56.01 43.35,55.75 | 43.35,60.83 U$1.6 | 43.35,60.83 43.6,61.09 43.6,63.67 v43.69,63.75 | 43.6,60.58 43.6,62.4 | 43.35,55.75 U$1.10 | 43.35,55.75 43.6,55.5 43.6,54.74 | 43.6,54.74 43.6,59.31
  Top 0.508: IC2.1 109.5,18.43 C21.2 C22.2 109.64,13.97 110.15,13.46 C23.2 C1.2 110.91,8.47 v111,8.38
  Top 2.032: Q6.S 86.61,12.17 87.63,11.15 v87.63,9.4 | v87.63,33.53 87.63,36.55 86.61,37.57 Q4.S | Q2.S 85.6,64.24 87.63,62.2 v87.63,61.47
  Bottom 0.254: v101.09,25.65 101.09,26.42 | v107.19,56.39 106.43,56.64 | v104.14,33.53 103.89,33.27
  Bottom 0.508: v111,8.38 111,8.13
  pour Bottom (isolate 0.381, rank 3): 1.27,87.63 1.27,1.27 124.46,1.27 124.46,87.63
N$1
  Top 0.254: U$1.16 55.63,57.02 55.88,57.28 R27.1 54.86,58.08 54.61,58.33 54.61,61.21 54.86,61.47 56.9,61.47 57.15,61.72 C4.2
N$2
  Top 0.254: U$1.13 52.2,53.21 52.83,52.58 R26.1 55.03,53.59 55.28,53.85 56.48,53.85 56.73,54.1 C6.2
N$3
  Top 0.254: U$1.8 38.73,58.29 38.1,57.66 34.12,57.66 33.87,57.91 R4.2
N$4
  Top 0.254: U$1.1 41.03,72.64 41.29,72.9 C5.1 55.03,73.91 55.28,74.17 59.86,74.17 60.11,73.91 R28.1
N$5
  Top 0.254: JP1.5 26.67,18.8 18.41,27.05 IC1.10
N$6
  Top 0.254: IC1.9 17.14,26.54 20.07,23.62 20.07,10.16 24.13,6.1 JP1.6
N$7
  Top 0.254: R2.1 33.78,61.47 34.2,61.05 R3.1 38.01,61.05 39.5,59.56 U$1.7
N$11
  Top 0.254: JP1.11 11.43,23.37 10.79,24 IC1.4
N$12
  Top 0.254: IC1.3 9.53,24 8.89,23.37 JP1.12
N$13
  Top 0.254: IC1.2 8.26,24.77 7.11,23.62 7.11,10.16 6.35,9.4 JP1.13
N$14
  Top 0.254: C7.2 37.34,55.12 39.24,57.02 U$1.9
N$15
  Top 0.254: U$1.14 48.51,54.48 48.26,54.23 48.26,45.47 48.51,45.21 61.72,45.21 61.98,44.96 61.98,29.97 64.77,27.18 R10.1
N$16  (via drill 0.6)
  Top 0.254: U$1.17 52.45,58.29 v53.59,59.44 | v61.47,69.34 62.48,69.34 64.43,71.29 R9.1
  Bottom 0.254: v53.59,59.44 63.75,59.44 64.01,59.69 64.01,64.77 62.23,66.55 62.23,68.58 v61.47,69.34
N$17
  Top 0.254: U$1.19 47.75,60.83 47.5,60.58 47.5,44.45 47.75,44.2 60.71,44.2 60.96,43.94 60.96,8.38 61.21,8.13 R8.1
N$18  (via drill 0.6)
  Top 0.254: R7.1 75.6,61.21 65.28,61.21 v62.74,63.75 | U$1.21 52.45,63.37 v53.59,64.52
  Bottom 0.254: v53.59,64.52 55.37,62.74 61.72,62.74 v62.74,63.75
N$19  (via drill 0.6)
  Top 0.254: R6.1 65.02,33.53 64.77,33.78 64.77,52.07 62.23,54.61 62.23,61.21 v62.74,61.72 | U$1.22 51.94,64.64 v53.59,66.29
  Bottom 0.254: v53.59,66.29 52.07,64.77 52.07,62.23 52.32,61.98 62.48,61.98 v62.74,61.72
N$20  (via drill 0.6)
  Top 0.254: v48.26,68.07 48.26,67.44 48.51,67.18 U$1.24 | R5.1 v66.04,57.15
  Bottom 0.254: v66.04,57.15 66.04,67.06 66.55,67.56 66.55,72.14 66.29,72.39 51.05,72.39 48.26,69.6 v48.26,68.07
N$24
  Top 0.508: D2.C D1.A
N$28
  Top 0.508: D4.C D3.A
N$29
  Top 0.508: D6.C D5.A
N$32
  Top 0.254: U$4.15 92.08,77.85 90.59,79.34 R14.1 R15.1
N$33
  Top 0.254: U$4.13 94.61,78.74 94.87,78.99 95.85,78.99 96.1,79.25 R16.1 C12.1
N$35
  Top 0.254: U$4.10 98.42,73.06 98.68,72.81 C10.1
N$36
  Top 0.254: U$4.11 97.16,78.49 97.92,79.25 103.38,79.25 103.63,79.5 C11.1
N$37
  Top 0.254: R18.1 90.34,55.12 | 90.34,55.12 90.59,55.37 R17.1 | U$3.15 92.08,54.86 91.82,55.12 90.84,55.12 | 90.34,55.12 90.84,55.12 | 90.84,55.12 90.59,55.37 90.59,55.68
N$38
  Top 0.254: U$3.13 94.61,54.36 94.87,54.61 95.85,54.61 96.1,54.86 R19.1 C16.1
N$39
  Top 0.254: C14.1 98.68,47.5 98.42,47.75 U$3.10
N$40
  Top 0.254: C15.1 103.29,54.19 102.11,55.37 98.3,55.37 97.16,54.23 U$3.11
N$43
  Top 0.254: 90.34,29.72 90.59,29.97 | R21.1 90.34,29.72 | U$5.15 92.08,29.46 91.82,29.72 90.84,29.72 90.59,29.97 | 90.59,29.97 R20.1 | 90.34,29.72 91.06,29.72
N$44
  Top 0.254: C20.1 R22.1 96.1,29.46 95.85,29.21 94.87,29.21 94.61,28.96 U$5.13
N$45
  Top 0.254: U$5.10 98.42,21.5 98.68,21.25 C18.1
N$46
  Top 0.254: C19.1 97.41,28.03 97.16,27.77 U$5.11
N$53
  Top 0.254: R27.2 59.94,59.78 60.2,60.03 D8.C
N$54
  Top 0.254: D9.C 59.18,69.09 61.81,71.72 R28.2
N$55
  Top 0.254: D7.C 52.07,50.8 52.32,51.05 56.48,51.05 56.73,51.31 R26.2
PGC
  Top 0.254: JP3.5 25.91,38.61 25.65,38.86 25.65,41.91 25.4,42.16 21.21,42.16 20.95,41.91 20.95,39.37 IC1.12 20.95,27.81 30.48,18.29 30.48,4.32 31.75,3.05 JP1.3
PGD
  Top 0.254: JP3.4 26.16,42.93 19.94,42.93 19.68,42.67 IC1.11 19.68,27.56 29.21,18.03 JP1.4
PHASEA
  Top 0.508: U$4.5 U$4.6 U$4.7 U$4.8
  Top 2.032: JP4.1 111.25,56.39 109.22,58.42 109.22,61.98 104.32,66.88 U$4.8
PHASEB
  Top 0.508: U$3.5 U$3.6 U$3.7 U$3.8
  Top 2.032: U$3.8 104.98,41.48 114.89,51.39 JP4.2
PHASEC
  Top 0.508: U$5.5 U$5.6 U$5.7 U$5.8
  Top 2.032: U$5.8 104.65,16.08 106.68,18.11 106.68,38.1 114.97,46.39 JP4.3
PMCLR  (via drill 0.6)
  Top 0.254: R1.2 2.54,39.04 2.79,38.79 IC1.1 | IC1.1 6.99,26.04 5.59,24.64 5.59,11.43 3.81,9.65 JP1.14 | IC1.1 6.99,41.6 7.24,41.86 v13.97,41.86
  Bottom 0.254: v13.97,41.86 18.49,41.86 20.32,43.69 20.32,48.51 20.57,48.77 JP3.1
PWM1H1  (via drill 0.6)
  Top 0.254: JP2.4 11.43,65.28 10.79,64.64 v10.79,62.74 IC1.25 | U$1.5 37.9,62.1 v37.69,62.31
  Bottom 0.254: v37.69,62.31 11.23,62.31 v10.79,62.74
PWM1H2  (via drill 0.6)
  Top 0.254: IC1.23 13.34,63.12 v16.51,66.29 JP2.6 | U$1.2 34.42,65.91 v34.29,66.04
  Bottom 0.254: v34.29,66.04 16.76,66.04 v16.51,66.29
PWM1H3  (via drill 0.6)
  Top 0.254: JP2.8 21.59,67.82 16,62.23 16,54.36 15.49,53.85 15.49,51.31 15.88,50.93 v15.88,50.8 IC1.21 | U$1.12 40.01,53.21 v38.1,51.31
  Bottom 0.254: v38.1,51.31 16.38,51.31 v15.88,50.8
PWM1L1  (via drill 0.6)
  Top 0.254: JP2.3 8.89,72.9 9.53,72.26 v9.53,66.55 IC1.26 | U$1.4 35.94,63.37 v35.81,63.5
  Bottom 0.254: v35.81,63.5 12.57,63.5 v9.53,66.55
PWM1L2  (via drill 0.6)
  Top 0.254: IC1.24 12.06,63.88 v13.97,65.79 JP2.5 | U$1.3 33.4,64.64 v33.02,65.02
  Bottom 0.254: v33.02,65.02 14.73,65.02 v13.97,65.79
PWM1L3  (via drill 0.6)
  Top 0.254: JP2.7 19.05,67.06 14.61,62.61 v14.61,55.12 IC1.22 | U$1.11 38.99,54.48 v37.59,53.09
  Bottom 0.254: v37.59,53.09 16.64,53.09 v14.61,55.12
RX>DOUT
  Top 0.254: JP1.1 36.83,15.75 23.5,29.08 23.5,33.02 | 23.5,33.02 23.5,33.27 | 23.5,33.27 IC1.14 | U$2.2 32.72,33.02 23.75,33.02 | 23.5,33.02 23.75,33.02 | 23.5,33.27 23.75,33.02
TX>DIN
  Top 0.254: JP2.14 36.83,72.39 23.5,59.05 23.5,51.59 | 23.5,51.31 23.5,51.03 | 23.5,51.03 IC1.15 | 23.5,51.31 23.5,51.59 | U$2.3 39.88,34.29 40.13,34.54 40.13,48.51 39.88,48.77 32.26,48.77 29.72,51.31 23.77,51.31 | 23.77,51.31 23.5,51.31 | 23.77,51.31 23.5,51.59 | 23.77,51.31 23.5,51.03
VCAP
  Top 0.254: IC1.20 17.14,51.56 16.89,51.82 16.89,52.54 C2.1 16.93,61.38 24.13,68.58 JP2.9
(copper drawn outside any net)
  shapes: Top area x6

### Text on the board
tPlace: 3.3V | GND | PWM1L1 | PWM1H1 | PWM1L2 | PWM1H2 | PWM1L3 | PWM1H3 | VDDCORE | GND | RB9 | RB8 | RB7 | RP6 | VOCL | 330k | 1K | 1K | VOCH | FAULT | 0.1uF | DNI | BSCAP | BSR | 1K | 1K | 1 | 1nF | HIP4086 | 2 | DIODE | IRLR024 | IRLR024 | 3 | DNI | BSCAP | DIODE | DIODE | DIODE | BSR | 1k | 1k | UV | DT | 330K | FAULT | BSCAP | VOCL | VOCH | A | dsPIC33FJ | RFSH | 12MC202 | 0.1uF | BSR | B | DNI | ,1UF | DIODE | 1nF | 2.2k | C | 0.1uF | IRLR024 | IRLR024 | DIODE | DIODE | 3.3V | 1k | 1k | VOCL | VOCH | 330k | FAULT | 5V | DNI | .1UF | 12V | 1nF | 3.3V REG | REG1117 | .1uF | 1N4733A-TR | 30 Ohm | XBee | 10uF | 10uF | 48V | ERG-2SJ300 | 1N4742A-TR | IRLR024 | IRLR024 | DIODE | .1uF | SQP500JB-360R | DIODE | 1k | 1k | GND | MCLR | RA0 | RA1 | RB0 | AN3 | AN4 | AN5 | GND | RA2 | RA3 | PGD3 | PGC3 | 3.3V | RP5